# EAGLE design gyro_board (EAGLE 6.5.0)
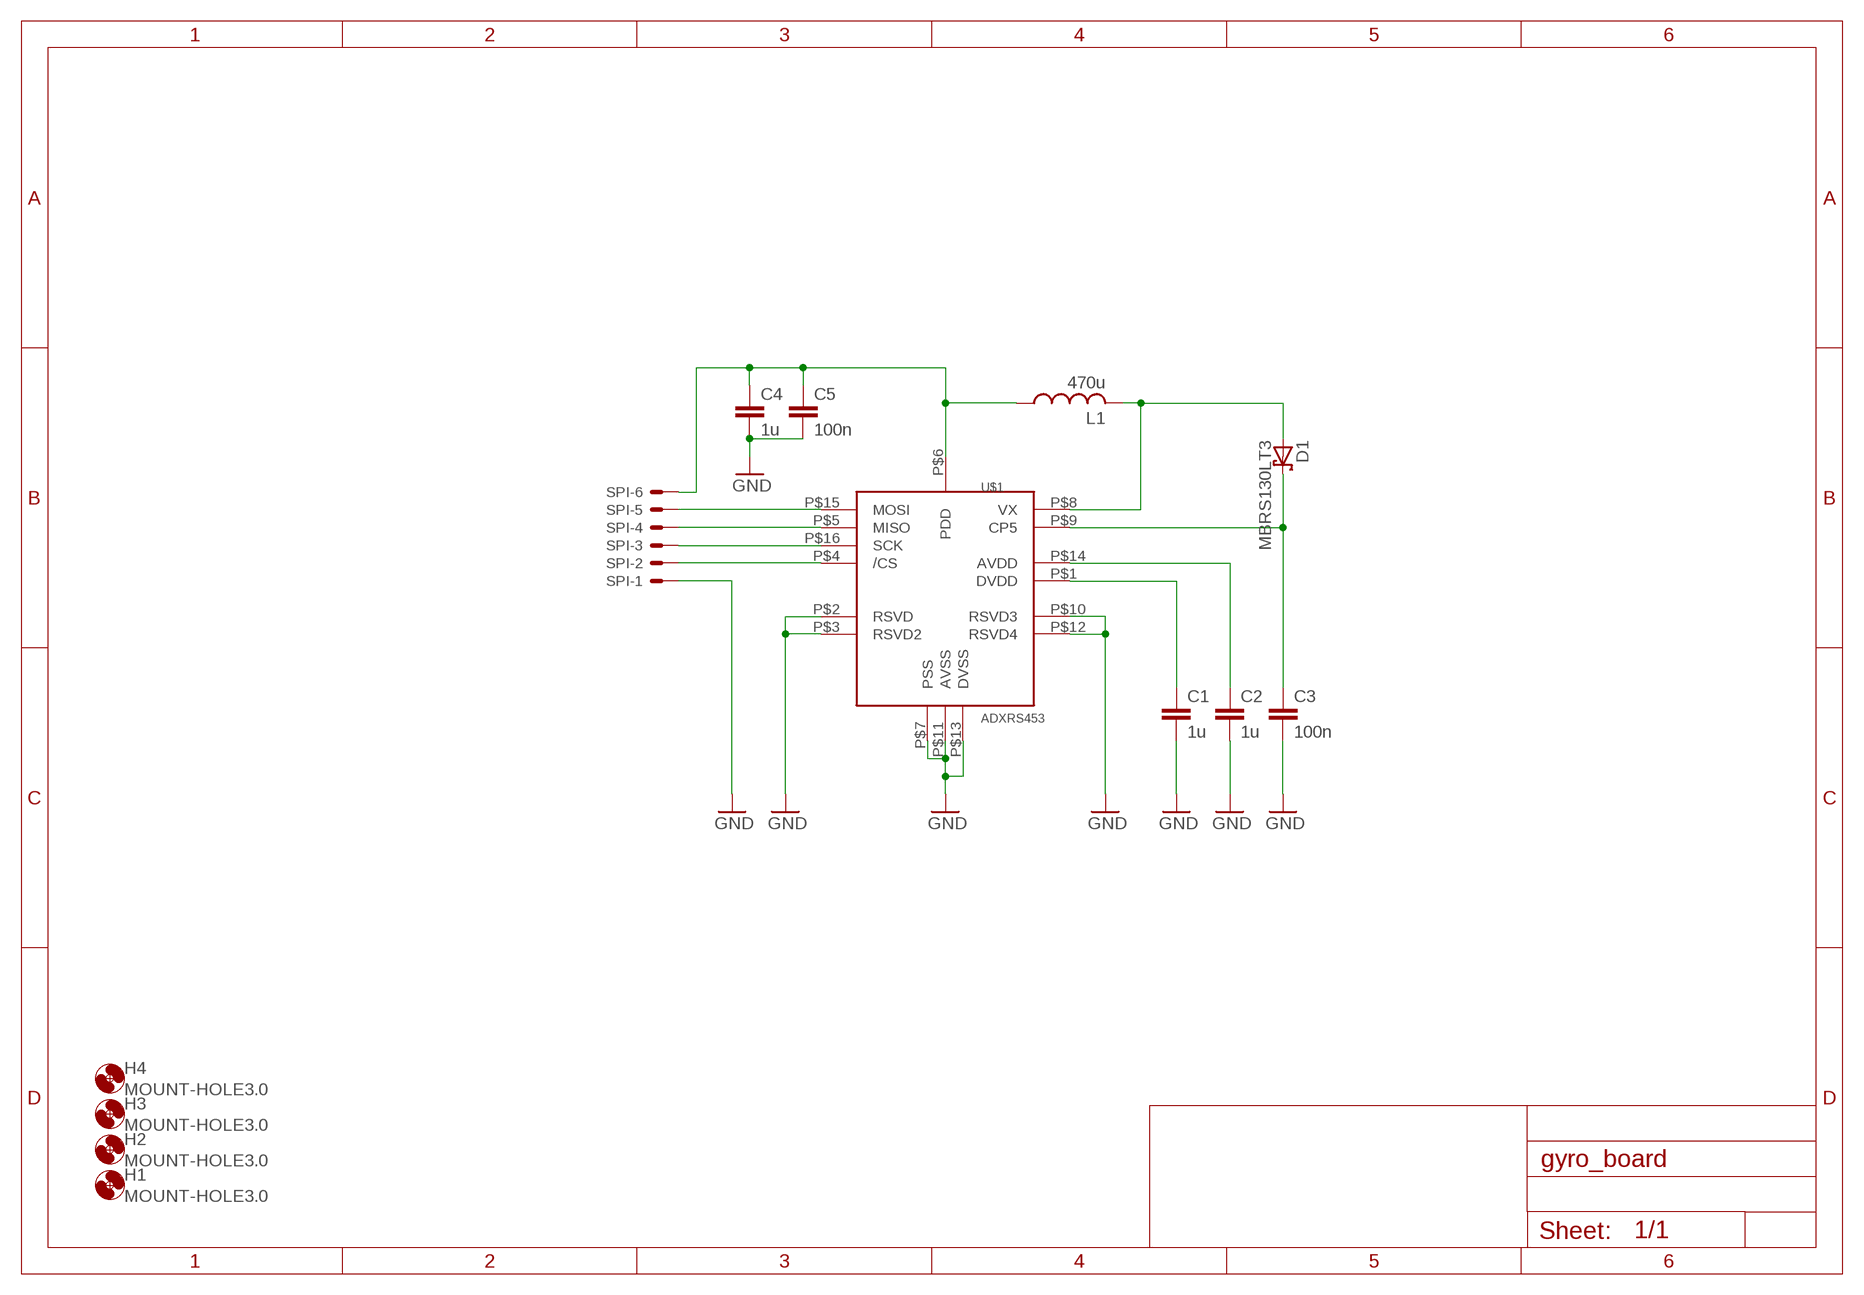
[diagram p0: schematic, sheet 1]

## Parts
C1  1u  C-EUC0603  [C0603]
C2  1u  C-EUC0603  [C0603]
C3  100n  C-EUC0603  [C0603]
C4  1u  C-EUC0603  [C0603]
C5  100n  C-EUC0603  [C0603]
D1  MBRS130LT3  [SMB]
H1  MOUNT-HOLE3.0  [3,0]
H2  MOUNT-HOLE3.0  [3,0]
H3  MOUNT-HOLE3.0  [3,0]
H4  MOUNT-HOLE3.0  [3,0]
L1  470u  L-USL1812  [L1812]
SPI  22-23-2061  [22-23-2061]
U$1  ADXRS453  [SOIC_CAV]

## Nets
GND: C1.2 C2.2 C3.2 C4.2 C5.2 SPI.1 U$1.P$2(RSVD) U$1.P$3(RSVD2) U$1.P$7(PSS) U$1.P$10(RSVD3) U$1.P$11(AVSS) U$1.P$12(RSVD4) U$1.P$13(DVSS)
N$1: SPI.5 U$1.P$15(MOSI)
N$2: C4.1 C5.1 L1.1 SPI.6 U$1.P$6(PDD)
N$4: D1.A L1.2 U$1.P$8(VX)
N$5: C1.1 U$1.P$1(DVDD)
N$6: C2.1 U$1.P$14(AVDD)
N$7: C3.1 D1.C U$1.P$9(CP5)
N$8: SPI.2 U$1.P$4(/CS)
N$9: SPI.3 U$1.P$16(SCK)
N$10: SPI.4 U$1.P$5(MISO)

## Library data of the parts
C1-C5 = rcl:C-EU: CAPACITOR, European symbol
D1 = diode:MBRS130LT3: Schottky Power Rectifier Source: http://www.onsemi.com/pub/Collateral/MBRS130LT3-D.PDF
H1-H4 = holes:MOUNT-HOLE: MOUNTING HOLE with drill center marker
L1 = rcl:L-US: INDUCTOR, American symbol
SPI = con-molex:22-23-2061: .100" (2.54mm) Center Header - 6 Pin; MF: MOLEX; MPN: 22-23-2061; OC_FARNELL: 1462922; OC_NEWARK: 27C1933
U$1 = perso:ADXRS453

## Board
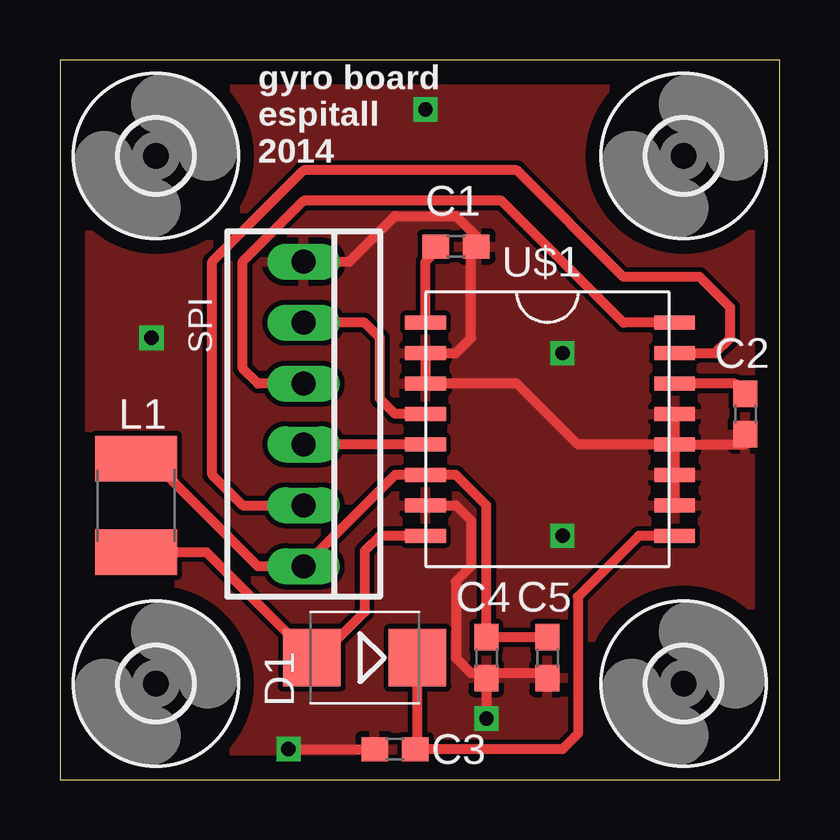
[diagram p1: board, top side]
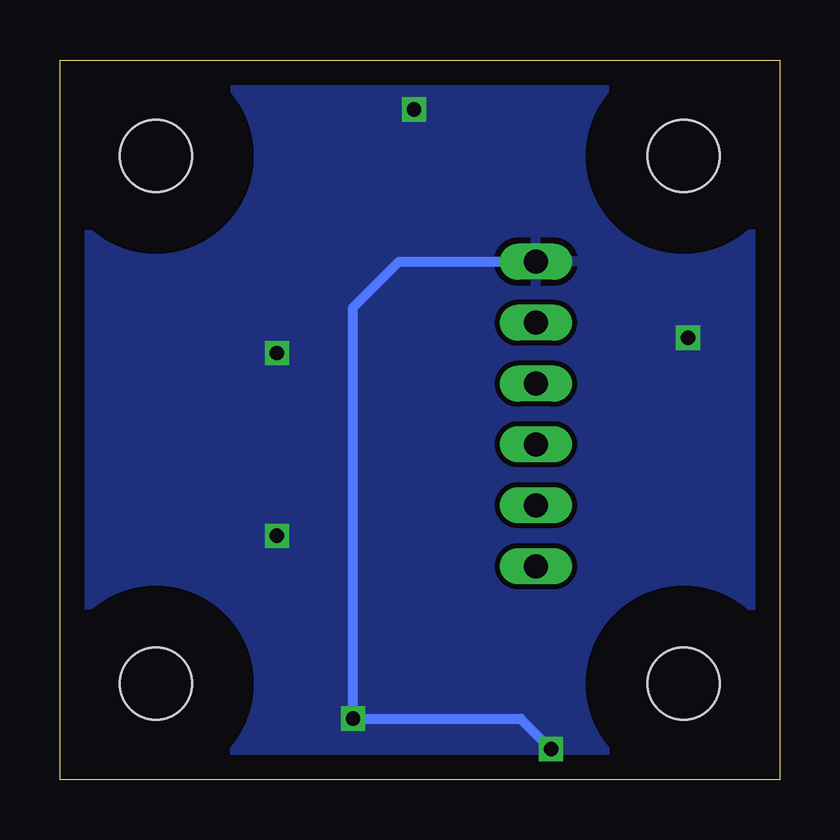
[diagram p2: board, bottom side, seen from below]

Size 30 x 30 mm. Coordinates in mm from the lower left corner, seen from the top.
Outline: 0,0 30,0 30,30 0,30 0,0
Copper layers (1*16): Top 0.035mm / dielectric 1.5mm / Bottom 0.035mm
Design rules "default": minimum track width 10mil, minimum drill 24mil, track to track 8mil, track to pad 8mil, pad to pad 8mil, via to via 8mil, smd to smd 8mil, copper to edge 40mil, drill to drill 8mil, minimum pad ring 10mil, minimum via ring 8mil, stop-mask expansion 4mil, vias tented up to drill 0mil, thermal gap 10mil

### Footprints (pad centres in the part's own frame; a part is rotated, then mirrored left to right if it is on the bottom)
C0603 = smd 1.1 x 1: 1 -0.85,0; 2 0.85,0
SMB = smd 2.4 x 2.4: A 2.2,0; C -2.2,0
3,0 = hole 3: 0,0
L1812 = smd 1.9 x 3.4: 1 -1.95,0; 2 1.95,0
22-23-2061 = drill 1 long: 1 -6.35,0; 2 -3.81,0; 3 -1.27,0; 4 1.27,0; 5 3.81,0; 6 6.35,0
SOIC_CAV = smd 0.572 x 1.691: P$1 -3.81,-5.08; P$2 -2.54,-5.08; P$3 -1.27,-5.08; P$4 0,-5.08; P$5 1.27,-5.08; P$6 2.54,-5.08; P$7 3.81,-5.08; P$8 5.08,-5.08; P$9 5.08,5.306; P$10 3.81,5.306; P$11 2.54,5.306; P$12 1.27,5.306; P$13 0,5.306; P$14 -1.27,5.306; P$15 -2.54,5.306; P$16 -3.81,5.306

### Placement (x,y rotation side)
C1  16.51,22.23 0 top
C2  28.57,15.24 270 top
C3  13.97,1.27 180 top
C4  17.78,5.08 270 top
C5  20.32,5.08 270 top
D1  12.7,5.08 180 top
H1  26,26 0 top
H2  26,4 0 top
H3  4,26 0 top
H4  4,4 0 top
L1  3.17,11.43 270 top
SPI  10.16,15.24 270 top
U$1  20.32,15.24 270 top

### Tracks (layer width: path | path; a pad name or v marks a point on that pad's centre or on a via)
GND  (via drill 0.6)
  Top 0.406: U$1.P$7 16.51,11.43 17.14,10.79 17.14,8.89 16.51,8.26 16.51,5.08 17.14,4.45 20.11,4.45 C5.2 | U$1.P$10 U$1.P$12 | U$1.P$12 U$1.P$13 | U$1.P$12 28.57,13.97 C2.2 | SPI.1 12.06,21.59 13.97,23.5 16.51,23.5 17.36,22.64 C1.2 17.14,22.01 17.14,18.41 16.51,17.78 U$1.P$2 U$1.P$3 19.05,16.51 21.59,13.97 U$1.P$12 | C4.2 v17.78,2.54 | v9.53,1.27 C3.2
  Bottom 0.406: SPI.1 15.88,21.59 17.78,19.68 v17.78,2.54 10.79,2.54 v9.53,1.27
  other vias: 3.81,18.41 15.24,27.94 20.95,17.78 20.95,10.16
  pour Top: 0,0 29.84,0 29.84,29.84 0,29.84
  pour Bottom: -0.64,-1.27 31.11,-1.27 31.11,2.54 31.11,31.11 -0.64,31.11
N$1
  Top 0.406: U$1.P$15 27.3,17.78 27.94,18.41 27.94,19.68 26.67,20.95 23.5,20.95 19.05,25.4 10.16,25.4 6.35,21.59 6.35,12.7 7.62,11.43 SPI.5
N$2
  Top 0.406: L1.1 3.85,12.7 4.45,12.7 8.26,8.89 SPI.6 13.97,12.7 U$1.P$6 16.51,12.7 17.78,11.43 C4.1 C5.1
N$4
  Top 0.406: L1.2 6.1,9.48 D1.A 11.13,5.71 11.43,5.71 12.7,6.99 12.7,9.53 13.34,10.16 U$1.P$8
N$5
  Top 0.406: U$1.P$1 15.24,21.59 15.66,22.01 C1.1
N$6
  Top 0.406: C2.1 28.16,16.51 U$1.P$14
N$7
  Top 0.406: D1.C 14.9,1.27 C3.1 20.95,1.27 21.59,1.91 21.59,7.62 24.13,10.16 U$1.P$9
N$8
  Top 0.406: U$1.P$4 13.97,15.24 13.34,15.88 13.34,18.41 12.7,19.05 SPI.2
N$9
  Top 0.406: SPI.3 8.26,16.51 7.62,17.14 7.62,21.59 10.16,24.13 18.41,24.13 23.5,19.05 U$1.P$16
N$10
  Top 0.406: U$1.P$5 SPI.4

### Text on the board
tPlace: gyro board / espitall / 2014